# Altium schematic sheet Power.SchDoc
size A4; SheetNumber: 4; SheetTotal: 15
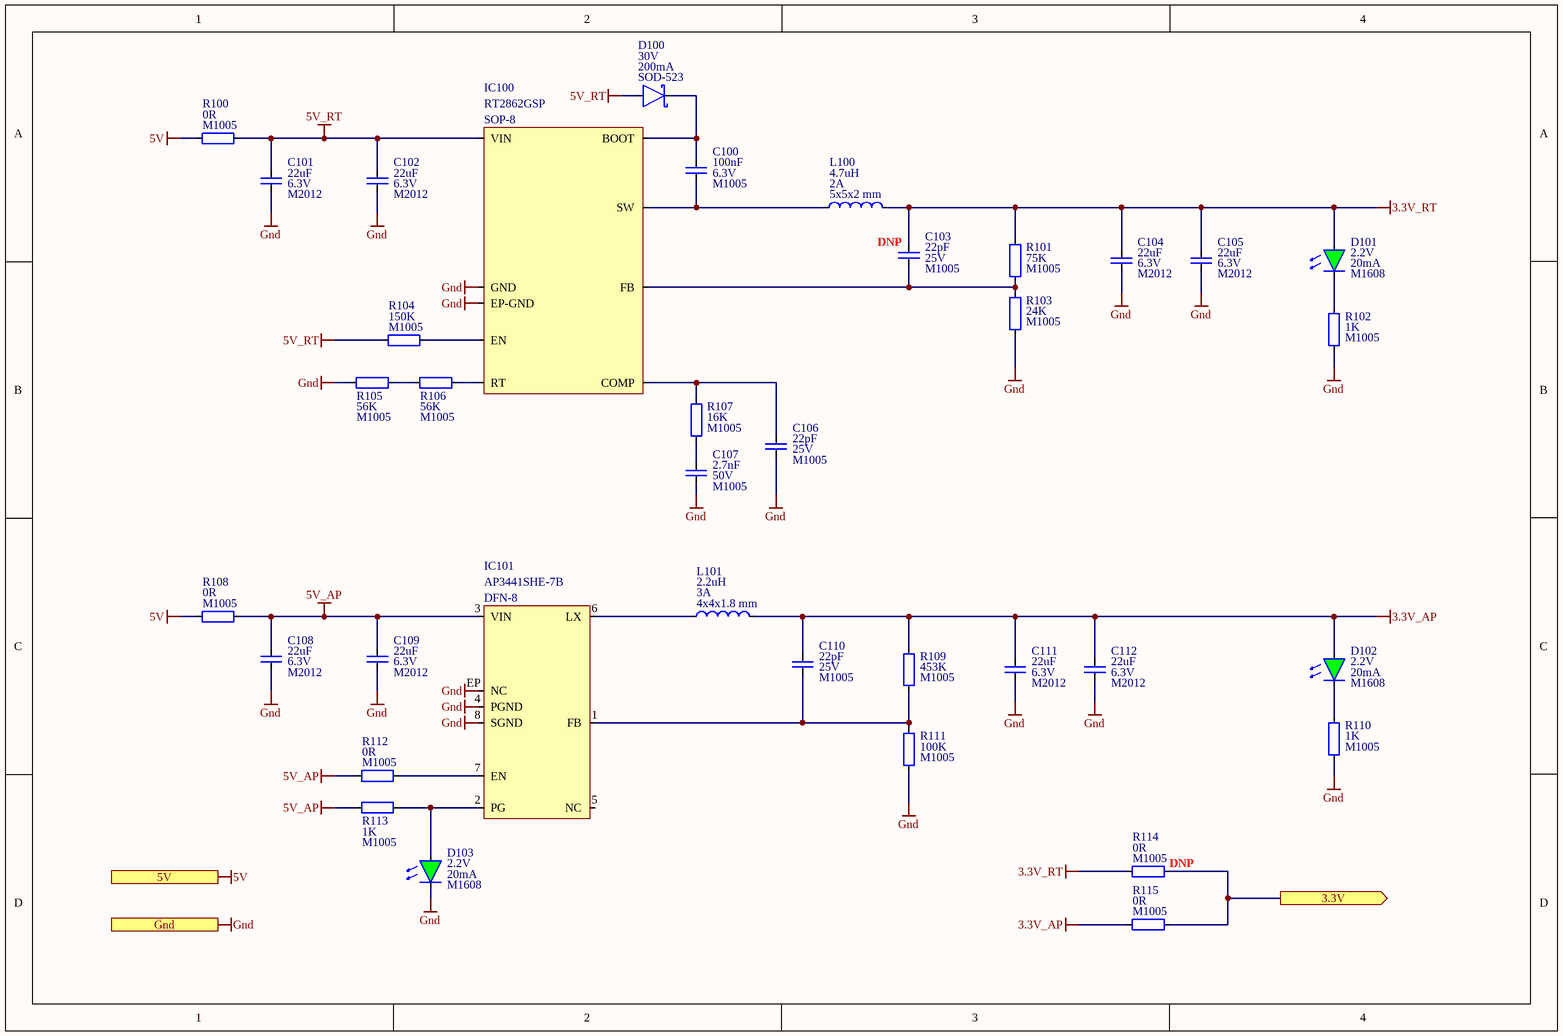
[diagram p0: Power.SchDoc]

## Parts
C100  value 100nF  Voltage: 6.3V  Package: M1005  [Capacitor_Ceramic_M1005_I0402]  (hidden comment: Capacitor_Ceramic)
C101  value 22uF  Voltage: 6.3V  Package: M2012  [Capacitor_Ceramic_M2012_I0805]  (hidden comment: Capacitor_Ceramic)
C102  value 22uF  Voltage: 6.3V  Package: M2012  [Capacitor_Ceramic_M2012_I0805]  (hidden comment: Capacitor_Ceramic)
C103  value 22pF  Voltage: 25V  Package: M1005  [Capacitor_Ceramic_M1005_I0402]  (hidden comment: Capacitor_Ceramic)
C104  value 22uF  Voltage: 6.3V  Package: M2012  [Capacitor_Ceramic_M2012_I0805]  (hidden comment: Capacitor_Ceramic)
C105  value 22uF  Voltage: 6.3V  Package: M2012  [Capacitor_Ceramic_M2012_I0805]  (hidden comment: Capacitor_Ceramic)
C106  value 22pF  Voltage: 25V  Package: M1005  [Capacitor_Ceramic_M1005_I0402]  (hidden comment: Capacitor_Ceramic)
C107  value 2.7nF  Voltage: 50V  Package: M1005  [Capacitor_Ceramic_M1005_I0402]  (hidden comment: Capacitor_Ceramic)
C108  value 22uF  Voltage: 6.3V  Package: M2012  [Capacitor_Ceramic_M2012_I0805]  (hidden comment: Capacitor_Ceramic)
C109  value 22uF  Voltage: 6.3V  Package: M2012  [Capacitor_Ceramic_M2012_I0805]  (hidden comment: Capacitor_Ceramic)
C110  value 22pF  Voltage: 25V  Package: M1005  [Capacitor_Ceramic_M1005_I0402]  (hidden comment: Capacitor_Ceramic)
C111  value 22uF  Voltage: 6.3V  Package: M2012  [Capacitor_Ceramic_M2012_I0805]  (hidden comment: Capacitor_Ceramic)
C112  value 22uF  Voltage: 6.3V  Package: M2012  [Capacitor_Ceramic_M2012_I0805]  (hidden comment: Capacitor_Ceramic)
D100  Current: 200mA  Voltage: 30V  Package: SOD-523  [Diode_SOD-523_SC-79]  (hidden comment: Diode_Schottky)
D101  Current: 20mA  Voltage: 2.2V  Package: M1608  [Diode_Smd_M1608_I0603_Green-Yellow]  (hidden comment: Diode_Led)
D102  Current: 20mA  Voltage: 2.2V  Package: M1608  [Diode_Smd_M1608_I0603_Green-Yellow]  (hidden comment: Diode_Led)
D103  Current: 20mA  Voltage: 2.2V  Package: M1608  [Diode_Smd_M1608_I0603_Green-Yellow]  (hidden comment: Diode_Led)
IC100  Manufacturer Part Number: RT2862GSP  Package: SOP-8  [Richtek, RT2862xSP, SOP-8]  (hidden comment: Richtek, RT2862xSP)
IC101  Manufacturer Part Number: AP3441SHE-7B  Package: DFN-8  [DFN-8, 2mm x 2mm, 0.5mm]  (hidden comment: Diodes, AP3441)
L100  value 4.7uH  Saturation Current: 2A  Package: 5x5x2 mm  [Taiyo Yuden - Power Inductor, 5050WK]  (hidden comment: Inductor)
L101  value 2.2uH  Saturation Current: 3A  Package: 4x4x1.8 mm  [Taiyo Yuden - Power Inductor, 4040TK]  (hidden comment: Inductor)
R100  value 0R  Package: M1005  [Resistor_Smd_M1005_I0402]  (hidden comment: Resistor)
R101  value 75K  Package: M1005  [Resistor_Smd_M1005_I0402]  (hidden comment: Resistor)
R102  value 1K  Package: M1005  [Resistor_Smd_M1005_I0402]  (hidden comment: Resistor)
R103  value 24K  Package: M1005  [Resistor_Smd_M1005_I0402]  (hidden comment: Resistor)
R104  value 150K  Package: M1005  [Resistor_Smd_M1005_I0402]  (hidden comment: Resistor)
R105  value 56K  Package: M1005  [Resistor_Smd_M1005_I0402]  (hidden comment: Resistor)
R106  value 56K  Package: M1005  [Resistor_Smd_M1005_I0402]  (hidden comment: Resistor)
R107  value 16K  Package: M1005  [Resistor_Smd_M1005_I0402]  (hidden comment: Resistor)
R108  value 0R  Package: M1005  [Resistor_Smd_M1005_I0402]  (hidden comment: Resistor)
R109  value 453K  Package: M1005  [Resistor_Smd_M1005_I0402]  (hidden comment: Resistor)
R110  value 1K  Package: M1005  [Resistor_Smd_M1005_I0402]  (hidden comment: Resistor)
R111  value 100K  Package: M1005  [Resistor_Smd_M1005_I0402]  (hidden comment: Resistor)
R112  value 0R  Package: M1005  [Resistor_Smd_M1005_I0402]  (hidden comment: Resistor)
R113  value 1K  Package: M1005  [Resistor_Smd_M1005_I0402]  (hidden comment: Resistor)
R114  value 0R  Package: M1005  [Resistor_Smd_M1005_I0402]  (hidden comment: Resistor)
R115  value 0R  Package: M1005  [Resistor_Smd_M1005_I0402]  (hidden comment: Resistor)

## Ports
3.3V (out), 5V (in), Gnd (in)

## Nets
3.3V_AP: C110.1 C111.1 C112.1 D102.A L101.2 R109.1 R115.1
3.3V_RT: C103.1 C104.1 C105.1 D101.A L100.2 R101.1 R114.1
5V: R100.1 R108.1 ; port 5V
5V_AP: C108.1 C109.1 IC101.3(VIN) R108.2 R112.1 R113.1
5V_RT: C101.1 C102.1 D100.A IC100.8-VIN(VIN) R100.2 R104.1
Gnd: C101.2 C102.2 C104.2 C105.2 C106.2 C107.2 C108.2 C109.2 C111.2 C112.2 D103.C IC100.4-GND(GND) IC100.EP-GND IC101.4(PGND) IC101.8(SGND) IC101.EP(NC) R102.2 R103.2 R105.1 R110.2 R111.2 ; port Gnd
3.3V: R114.2 R115.2 ; port 3.3V
NetC100_1: C100.1 D100.C IC100.2-BOOT(BOOT)
NetC100_2: C100.2 IC100.1-SW(SW) L100.1
NetC103_2: C103.2 IC100.5-FB(FB) R101.2 R103.1
NetC106_1: C106.1 IC100.6-COMP(COMP) R107.1
NetC107_1: C107.1 R107.2
NetC110_2: C110.2 IC101.1(FB) R109.2 R111.1
NetD101_C: D101.C R102.1
NetD102_C: D102.C R110.1
NetD103_A: D103.A IC101.2(PG) R113.2
NetIC100_3-EN: IC100.3-EN(EN) R104.2
NetIC100_7-RT: IC100.7-RT(RT) R106.2
NetIC101_6: IC101.6(LX) L101.1
NetIC101_7: IC101.7(EN) R112.2
NetR105_2: R105.2 R106.1

Not connected (* = marked no-connect by the designer): IC101 5(NC)

## Notes on the sheet
- (near C103) DNP
- (near R114) DNP

## Library data of the parts
C100 = Capacitor_Ceramic: Cap, Cer, 100nF, 6.3V, M1005; Manufacturer Part Number: 04026D104KAT4A; Manufacturer: Kyocera; Temperature Coefficient: X5R; Tolerance: 10%; ComponentLink1Description: Datasheet; ComponentLink1URL: E:\Altium\Datasheets\Capacitor\Kyocera - X5R.pdf; ComponentLink2Description: Supplier Link; ComponentLink2URL: https://www.digikey.com/en/products/detail/kyocera-avx/04026D104KAT4A/8107673; Supplier: Digikey; Supplier Part Number: 478-11504-1-ND; Operating Temperature, Min: +85℃; Operating Temperature, Max: -55℃; Quantity, Min: 1; Quantity, Max: 250000; Price, Min: 0.1; Supplier Currency: $; Price, Max: 0.00189; Supplier Link: https://www.digikey.com/en/products/detail/kyocera-avx/04026D104KAT4A/8107673; Component Type: Ceramic; Component Category: Capacitor
C101 C102 C104 C105 C108 C109 C111 C112 = Capacitor_Ceramic: Cap, Cer, 22uF, 6.3V, M2012; Manufacturer Part Number: GRM21BR60J226ME39K; Manufacturer: Murata; Temperature Coefficient: X5R; Tolerance: 20%; ComponentLink1Description: Datasheet; ComponentLink1URL: E:\Altium\Datasheets\Capacitor\Murata - Multilayer Ceramic Capacitors.pdf; ComponentLink2Description: Supplier Link; ComponentLink2URL: https://www.digikey.com/en/products/detail/murata-electronics/GRM21BR60J226ME39K/2546881; Supplier: Digikey; Supplier Part Number: 490-6471-1-ND; Operating Temperature, Min: +85℃; Operating Temperature, Max: -55℃; Quantity, Min: 1; Quantity, Max: 250000; Price, Min: 0.25; Supplier Currency: $; Price, Max: 0.02843; Supplier Link: https://www.digikey.com/en/products/detail/murata-electronics/GRM21BR60J226ME39K/2546881; Component Type: Ceramic; Component Category: Capacitor
C103 C106 C110 = Capacitor_Ceramic: Cap, Cer, 22pF, 25V, M1005; Manufacturer Part Number: 0402N220J250CT; Manufacturer: Walsin; Temperature Coefficient: C0G, NP0; Tolerance: 5%; ComponentLink1Description: Datasheet; ComponentLink1URL: E:\Altium\Datasheets\Capacitor\Walsin - Multilayer Ceramic Capacitors.pdf; ComponentLink2Description: Supplier Link; ComponentLink2URL: https://www.digikey.com/en/products/detail/walsin-technology-corporation/0402N220J250CT/9354779; Supplier: Digikey; Supplier Part Number: 1292-1282-1-ND; Operating Temperature, Min: +125℃; Operating Temperature, Max: -55℃; Quantity, Min: 1; Quantity, Max: 250000; Price, Min: 0.1; Supplier Currency: $; Price, Max: 0.00177; Supplier Link: https://www.digikey.com/en/products/detail/walsin-technology-corporation/0402N220J250CT/9354779; Component Type: Ceramic; Component Category: Capacitor
C107 = Capacitor_Ceramic: Cap, Cer, 2.7nF, 50V, M1005; Manufacturer Part Number: CC0402KRX7R9BB272; Manufacturer: Walsin; Temperature Coefficient: X7R; Tolerance: 10%; ComponentLink1Description: Datasheet; ComponentLink1URL: E:\Altium\Datasheets\Capacitor\Yageo - Surface-Mount Ceramic Multilayer Capacitors.pdf; ComponentLink2Description: Supplier Link; ComponentLink2URL: https://www.digikey.com/en/products/detail/yageo/CC0402KRX7R9BB272/302767; Supplier: Digikey; Supplier Part Number: 311-1033-1-ND; Operating Temperature, Min: +125℃; Operating Temperature, Max: -55℃; Quantity, Min: 1; Quantity, Max: 250000; Price, Min: 0.1; Supplier Currency: $; Price, Max: 0.00278; Supplier Link: https://www.digikey.com/en/products/detail/yageo/CC0402KRX7R9BB272/302767; Component Type: Ceramic; Component Category: Capacitor
D100 = Diode_Schottky: Diode, Schottky, 30V, 200mA, SOD-523; Manufacturer Part Number: CES521,L3F; Manufacturer: Toshiba; ComponentLink1Description: Datasheet; ComponentLink1URL: E:\Altium\Datasheets\Diode\Toshiba, CES521.pdf; ComponentLink2Description: Supplier Link; ComponentLink2URL: https://www.digikey.com/en/products/detail/toshiba-semiconductor-and-storage/CES521-L3F/3522356; Supplier: Digikey; Supplier Part Number: CES521L3FCT-ND; Operating Temperature, Min: ---℃; Operating Temperature, Max: +125℃; Quantity, Min: 1; Quantity, Max: 200000; Price, Min: 0.18; Price, Max: 0.018; Supplier Currency: $; Supplier Link: https://www.digikey.com/en/products/detail/toshiba-semiconductor-and-storage/CES521-L3F/3522356; Component Type: Schottky; Component Category: Diode
D101-D103 = Diode_Led: Diode, Led, Green-Yellow, 2.2V, 20mA, M1608; Manufacturer Part Number: SML-D12M1WT86; Manufacturer: Rohm; ComponentLink1Description: Datasheet; ComponentLink1URL: E:\Altium\Datasheets\Diode\Rohm, SML-D12x1 Series.pdf; ComponentLink2Description: Supplier Link; ComponentLink2URL: https://www.digikey.com/en/products/detail/rohm-semiconductor/SML-D12M1WT86/5843856; Supplier: Digikey; Supplier Part Number: SML-D12M1WT86CT-ND; Operating Temperature, Min: -40℃; Operating Temperature, Max: +85℃; Quantity, Min: 1; Quantity, Max: 75000; Price, Min: 0.25; Price, Max: 0.02838; Supplier Currency: $; Supplier Link: https://www.digikey.com/en/products/detail/rohm-semiconductor/SML-D12M1WT86/5843856; Component Type: Led; Component Category: Diode
IC100 = Richtek, RT2862xSP: IC, Power, Buck, SOP-8; ComponentLink1Description: Datasheet; ComponentLink1URL: E:\Altium\Datasheets\IC - Power - DC-DC\Richtek, RT2862.pdf; ComponentLink2Description: Supplier Link; ComponentLink2URL: https://www.digikey.com/en/products/detail/richtek-usa-inc/RT2862GSP/5880463; Supplier: Digikey; Supplier Part Number: 1028-1373-1-ND; Manufacturer: Richtek; Operating Temperature, Min: -40℃; Operating Temperature, Max: +85℃; Quantity, Min: 1; Quantity, Max: 5000; Price, Min: 1.93; Supplier Currency: $; Price, Max: 0.85214; Supplier Link: https://www.digikey.com/en/products/detail/richtek-usa-inc/RT2862GSP/5880463; Component Type: Power; Component Category: IC
IC101 = Diodes, AP3441: IC, Power, Buck, DFN-8, 2x2; Manufacturer: Richtek; ComponentLink1Description: Datasheet; ComponentLink1URL: E:\Altium\Datasheets\IC - Power - DC-DC\Diodes, AP3441.pdf; ComponentLink2Description: Supplier Link; ComponentLink2URL: https://www.digikey.com/en/products/detail/diodes-incorporated/AP3441SHE-7B/9765636; Supplier: Digikey; Supplier Part Number: AP3441SHE-7BDICT-ND; Operating Temperature, Min: -40℃; Operating Temperature, Max: +85℃; Quantity, Min: 1; Quantity, Max: 30000; Price, Min: 0.54; Supplier Currency: $; Price, Max: 0.13275; Supplier Link: https://www.digikey.com/en/products/detail/diodes-incorporated/AP3441SHE-7B/9765636; Component Type: Power; Component Category: IC
L100 = Inductor: Inductor, Power, 4.7uH, 2A, 5x5x2mm; Manufacturer Part Number: NRS5020T4R7MMGJ; Manufacturer: Taiyo Yuden; ComponentLink1Description: Datasheet; ComponentLink1URL: E:\Altium\Datasheets\Inductor\Taiyo Yuden - NRx Series.pdf; ComponentLink2Description: Supplier Link; ComponentLink2URL: https://www.digikey.com/en/products/detail/taiyo-yuden/NRS5020T4R7MMGJ/2230192; Supplier: Digikey; Supplier Part Number: 587-2407-1-ND; Operating Temperature, Min: -25℃; Operating Temperature, Max: +125℃; Quantity, Min: 1; Quantity, Max: 20000; Price, Min: 0.31; Price, Max: 0.1079; Supplier Currency: $; Supplier Link: https://www.digikey.com/en/products/detail/taiyo-yuden/NRS5020T4R7MMGJ/2230192; Component Type: Power Inductor; Component Category: Inductor
L101 = Inductor: Inductor, Power, 2.2uH, 3A, 4x4x1.8mm; Manufacturer Part Number: NRS4018T2R2MDGJ; Manufacturer: Taiyo Yuden; ComponentLink1Description: Datasheet; ComponentLink1URL: E:\Altium\Datasheets\Inductor\Taiyo Yuden - NRx Series.pdf; ComponentLink2Description: Supplier Link; ComponentLink2URL: https://www.digikey.com/en/products/detail/taiyo-yuden/NRS4018T2R2MDGJ/2648968; Supplier: Digikey; Supplier Part Number: 587-2890-1-ND; Operating Temperature, Min: -25℃; Operating Temperature, Max: +120℃; Quantity, Min: 1; Quantity, Max: 87500; Price, Min: 0.27; Price, Max: 0.08633; Supplier Currency: $; Supplier Link: https://www.digikey.com/en/products/detail/taiyo-yuden/NRS4018T2R2MDGJ/2648968; Component Type: Power Inductor; Component Category: Inductor
R100 R108 R112 R114 R115 = Resistor: Res, 0R, M1005; Manufacturer: Yageo; Manufacturer Part Number: RC0402FR-070RL; Component Category: Resistor; Component Type: Fixed Value; Tolerance: *; Supplier Link: https://www.digikey.com/en/products/detail/yageo/RC0402FR-070RL/2827570; Supplier Currency: $; Price, Max: 0.00109; Price, Min: 0.1; Quantity, Max: 50000; Quantity, Min: 1; Operating Temperature, Max: -55℃; Operating Temperature, Min: +155℃; Supplier Part Number: 311-0.0LRCT-ND; Supplier: Digikey; ComponentLink1Description: Datasheet; ComponentLink1URL: E:\Altium\Datasheets\Resistor\Yageo - RC_L Series.pdf; ComponentLink2Description: Supplier Link; ComponentLink2URL: https://www.digikey.com/en/products/detail/yageo/RC0402FR-070RL/2827570
R101 = Resistor: Res, 75K, 1%, M1005; Manufacturer: Yageo; Manufacturer Part Number: RC0402FR-0775KL; Component Category: Resistor; Component Type: Fixed Value; Tolerance: 1%; Supplier Link: https://www.digikey.com/en/products/detail/yageo/RC0402FR-0775KL/2827576; Supplier Currency: $; Price, Max: 0.00129; Price, Min: 0.1; Quantity, Max: 100000; Quantity, Min: 1; Operating Temperature, Max: -55℃; Operating Temperature, Min: +155℃; Supplier Part Number: 311-75KLRCT-ND; Supplier: Digikey; ComponentLink1Description: Datasheet; ComponentLink1URL: E:\Altium\Datasheets\Resistor\Yageo - RC_L Series.pdf; ComponentLink2Description: Supplier Link; ComponentLink2URL: https://www.digikey.com/en/products/detail/yageo/RC0402FR-0775KL/2827576
R102 R110 R113 = Resistor: Res, 1K, 1%, M1005; Manufacturer: Yageo; Manufacturer Part Number: RC0402FR-071KP; Component Category: Resistor; Component Type: Fixed Value; Tolerance: 1%; Supplier Link: https://www.digikey.com/en/products/detail/yageo/RC0402FR-071KP/4935269; Supplier Currency: $; Price, Max: 0.00282; Price, Min: 0.1; Quantity, Max: 100000; Quantity, Min: 1; Operating Temperature, Max: -55℃; Operating Temperature, Min: +155℃; Supplier Part Number: YAG1254CT-ND; Supplier: Digikey; ComponentLink1Description: Datasheet; ComponentLink1URL: E:\Altium\Datasheets\Resistor\Yageo - RC_L Series.pdf; ComponentLink2Description: Supplier Link; ComponentLink2URL: https://www.digikey.com/en/products/detail/yageo/RC0402FR-071KP/4935269
R103 = Resistor: Res, 24K, 1%, M1005; Manufacturer: Yageo; Manufacturer Part Number: RC0402FR-0724KL; Component Category: Resistor; Component Type: Fixed Value; Tolerance: 1%; Supplier Link: https://www.digikey.com/en/products/detail/yageo/RC0402FR-0724KL/2827581; Supplier Currency: $; Price, Max: 0.00129; Price, Min: 0.1; Quantity, Max: 100000; Quantity, Min: 1; Operating Temperature, Max: -55℃; Operating Temperature, Min: +155℃; Supplier Part Number: 311-24KLRCT-ND; Supplier: Digikey; ComponentLink1Description: Datasheet; ComponentLink1URL: E:\Altium\Datasheets\Resistor\Yageo - RC_L Series.pdf; ComponentLink2Description: Supplier Link; ComponentLink2URL: https://www.digikey.com/en/products/detail/yageo/RC0402FR-0724KL/2827581
R104 = Resistor: Res, 150K, 1%, M1005; Manufacturer: Yageo; Manufacturer Part Number: RC0402FR-07150KL; Component Category: Resistor; Component Type: Fixed Value; Tolerance: 1%; Supplier Link: https://www.digikey.com/en/products/detail/yageo/RC0402FR-07150KL/726542; Supplier Currency: $; Price, Max: 0.00129; Price, Min: 0.1; Quantity, Max: 100000; Quantity, Min: 1; Operating Temperature, Max: -55℃; Operating Temperature, Min: +155℃; Supplier Part Number: 311-150KLRCT-ND; Supplier: Digikey; ComponentLink1Description: Datasheet; ComponentLink1URL: E:\Altium\Datasheets\Resistor\Yageo - RC_L Series.pdf; ComponentLink2Description: Supplier Link; ComponentLink2URL: https://www.digikey.com/en/products/detail/yageo/RC0402FR-07150KL/726542
R105 R106 = Resistor: Res, 56K, 1%, M1005; Manufacturer: Yageo; Manufacturer Part Number: RC0402FR-0756KL; Component Category: Resistor; Component Type: Fixed Value; Tolerance: 1%; Supplier Link: https://www.digikey.com/en/products/detail/yageo/RC0402FR-0756KL/726635; Supplier Currency: $; Price, Max: 0.00129; Price, Min: 0.1; Quantity, Max: 100000; Quantity, Min: 1; Operating Temperature, Max: -55℃; Operating Temperature, Min: +155℃; Supplier Part Number: 311-56.0KLRCT-ND; Supplier: Digikey; ComponentLink1Description: Datasheet; ComponentLink1URL: E:\Altium\Datasheets\Resistor\Yageo - RC_L Series.pdf; ComponentLink2Description: Supplier Link; ComponentLink2URL: https://www.digikey.com/en/products/detail/yageo/RC0402FR-0756KL/726635
R107 = Resistor: Res, 16K, 1%, M1005; Manufacturer: Yageo; Manufacturer Part Number: RC0402FR-0716KL; Component Category: Resistor; Component Type: Fixed Value; Tolerance: 1%; Supplier Link: https://www.digikey.com/en/products/detail/yageo/RC0402FR-0716KL/726544; Supplier Currency: $; Price, Max: 0.00129; Price, Min: 0.1; Quantity, Max: 100000; Quantity, Min: 1; Operating Temperature, Max: -55℃; Operating Temperature, Min: +155℃; Supplier Part Number: 311-16.0KLRCT-ND; Supplier: Digikey; ComponentLink1Description: Datasheet; ComponentLink1URL: E:\Altium\Datasheets\Resistor\Yageo - RC_L Series.pdf; ComponentLink2Description: Supplier Link; ComponentLink2URL: https://www.digikey.com/en/products/detail/yageo/RC0402FR-0716KL/726544
R109 = Resistor: Res, 453K, 1%, M1005; Manufacturer: Yageo; Manufacturer Part Number: RC0402FR-07453KL; Component Category: Resistor; Component Type: Fixed Value; Tolerance: 1%; Supplier Link: https://www.digikey.com/en/products/detail/yageo/RC0402FR-07453KL/5281024; Supplier Currency: $; Price, Max: 0.00129; Price, Min: 0.1; Quantity, Max: 100000; Quantity, Min: 1; Operating Temperature, Max: -55℃; Operating Temperature, Min: +155℃; Supplier Part Number: YAG3164CT-ND; Supplier: Digikey; ComponentLink1Description: Datasheet; ComponentLink1URL: E:\Altium\Datasheets\Resistor\Yageo - RC_L Series.pdf; ComponentLink2Description: Supplier Link; ComponentLink2URL: https://www.digikey.com/en/products/detail/yageo/RC0402FR-07453KL/5281024
R111 = Resistor: Res, 100K, 1%, M1005; Manufacturer: Yageo; Manufacturer Part Number: RC0402FR-07100KP; Component Category: Resistor; Component Type: Fixed Value; Tolerance: 1%; Supplier Link: https://www.digikey.com/en/products/detail/yageo/RC0402FR-07100KP/12698883; Supplier Currency: $; Price, Max: 0.00282; Price, Min: 0.1; Quantity, Max: 100000; Quantity, Min: 1; Operating Temperature, Max: -55℃; Operating Temperature, Min: +155℃; Supplier Part Number: 13-RC0402FR-07100KPCT-ND; Supplier: Digikey; ComponentLink1Description: Datasheet; ComponentLink1URL: E:\Altium\Datasheets\Resistor\Yageo - RC_L Series.pdf; ComponentLink2Description: Supplier Link; ComponentLink2URL: https://www.digikey.com/en/products/detail/yageo/RC0402FR-07100KP/12698883